# Altium schematic sheet PowerSupply.SchDoc
size A4
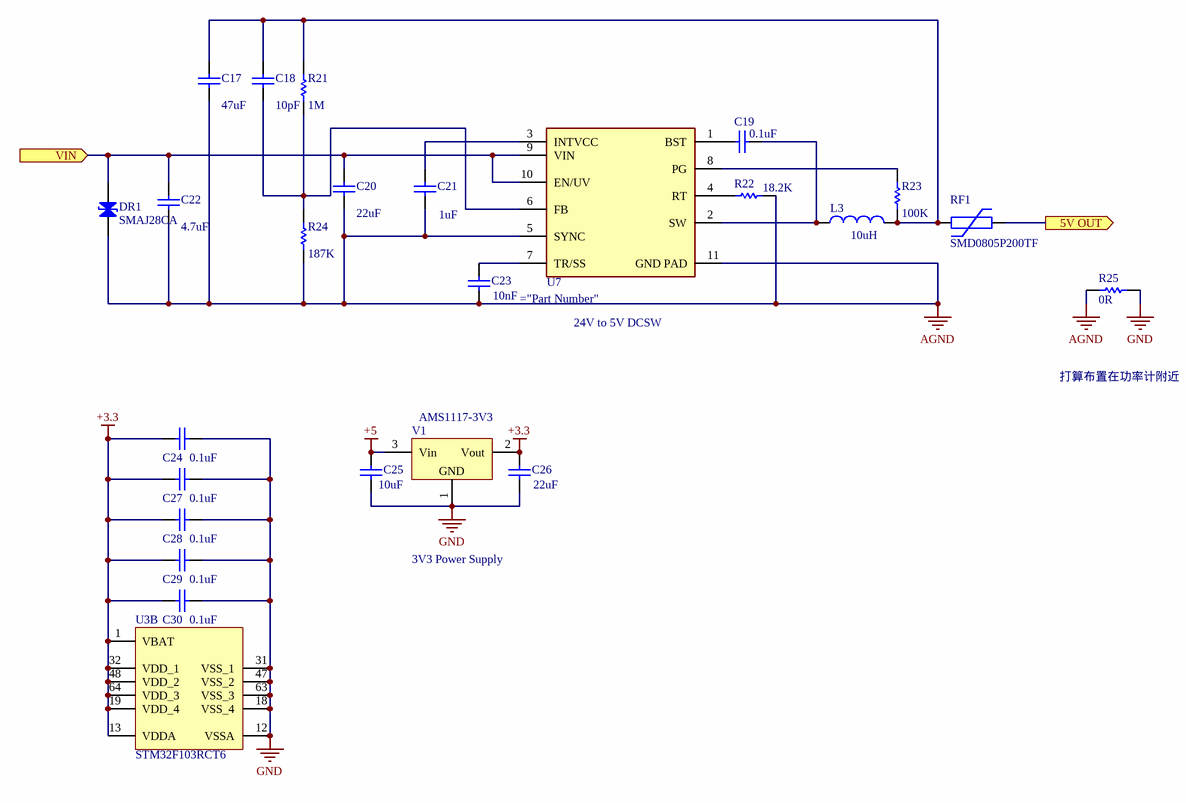
[diagram p0: PowerSupply.SchDoc]

## Parts
C17  value 47uF  [C1206]  (hidden comment: Cap)
C18  value 10pF  [C 0603_L]  (hidden comment: Cap)
C19  value 0.1uF  [C 0603_L]  (hidden comment: Cap)
C20  value 22uF  [C 1206_L]  (hidden comment: Cap)
C21  value 1uF  [C 0603_L]  (hidden comment: Cap)
C22  value 4.7uF  [C 1206_L]  (hidden comment: Cap)
C23  value 10nF  [C 0603_L]  (hidden comment: Cap)
C24  value 0.1uF  [0603C]  (hidden comment: Cap)
C25  value 10uF  [C 1206_L]  (hidden comment: Cap)
C26  value 22uF  [C 1206_L]  (hidden comment: Cap)
C27  value 0.1uF  [0603C]  (hidden comment: Cap)
C28  value 0.1uF  [0603C]  (hidden comment: Cap)
C29  value 0.1uF  [0603C]  (hidden comment: Cap)
C30  value 0.1uF  [0603C]  (hidden comment: Cap)
DR1  SMAJ28CA  [SMA]
L3  value 10uH  [XAL4040]  (hidden comment: Inductor)
R21  value 1M  [R 0603_L]  (hidden comment: Res1)
R22  value 18.2K  [R 0603_L]  (hidden comment: Res1)
R23  value 100K  [R 0603_L]  (hidden comment: Res1)
R24  value 187K  [R 0603_L]  (hidden comment: Res1)
R25  value 0R  [0805R]  (hidden comment: Res1)
RF1  SMD0805P200TF  [R 0805_L]
U3  STM32F103RCT6  [STM-LQFP64_N]  (part B of 2)
U7  LT8609EMSE#PBF  [LT8609EMS]  (value not drawn)
V1  AMS1117-3V3  [SOT223_N]

## Ports
5V OUT (out), VIN (in)

## Nets
+3.3: C24.1 C26.2 C27.1 C28.1 C29.1 C30.1 U3.1(VBAT) U3.13(VDDA) U3.19(VDD_4) U3.32(VDD_1) U3.48(VDD_2) U3.64(VDD_3) V1.2(Vout)
+5: C25.2 V1.3(Vin)
AGND: C17.1 C20.1 C21.1 C22.1 C23.1 DR1.2(K) R22.1 R24.2 R25.2 U7.5(SYNC) U7.11(GND_PAD)
GND: C24.2 C25.1 C26.1 C27.2 C28.2 C29.2 C30.2 R25.1 U3.12(VSSA) U3.18(VSS_4) U3.31(VSS_1) U3.47(VSS_2) U3.63(VSS_3) V1.1(GND)
5V OUT: RF1.2 ; port 5V OUT
VIN: C20.2 C22.2 DR1.1(A) U7.9(VIN) U7.10(EN/UV) ; port VIN
NetC17_2: C17.2 C18.2 L3.2 R21.1 R23.1 RF1.1
NetC18_1: C18.1 R21.2 R24.1 U7.6(FB)
NetC19_1: C19.1 L3.1 U7.2(SW)
NetC19_2: C19.2 U7.1(BST)
NetC21_2: C21.2 U7.3(INTVCC)
NetC23_2: C23.2 U7.7(TR/SS)
NetR22_2: R22.2 U7.4(RT)
NetR23_2: R23.2 U7.8(PG)

## Notes on the sheet
- 24V to 5V DCSW
- 打算布置在功率计附近
- 3V3 Power Supply

## Library data of the parts
C17 C25 C26 = Cap: X5R 25V; Published: 8-Jun-2000; LatestRevisionDate: 17-Jul-2002; LatestRevisionNote: Re-released for DXP Platform.; PackageReference: RAD-0.3; Publisher: Altium Limited; PackageDescription: Radial Cap, Thru-Hole; 2 Leads; 0.3 in Pin Spacing
C18 C23 = Cap: C0G 50V; Published: 8-Jun-2000; LatestRevisionDate: 17-Jul-2002; LatestRevisionNote: Re-released for DXP Platform.; PackageReference: RAD-0.3; Publisher: Altium Limited; PackageDescription: Radial Cap, Thru-Hole; 2 Leads; 0.3 in Pin Spacing
C19-C22 C24 C27-C30 = Cap: X5R 50V; Published: 8-Jun-2000; LatestRevisionDate: 17-Jul-2002; LatestRevisionNote: Re-released for DXP Platform.; PackageReference: RAD-0.3; Publisher: Altium Limited; PackageDescription: Radial Cap, Thru-Hole; 2 Leads; 0.3 in Pin Spacing
DR1 = DR: 瞬态电压抑制二极管; 版权归属: 源创客; BOM名称: 瞬态电压抑制二极管; 学习资源: www.ooocke.com
L3 = Inductor: XAL4040 10uH; Code_IEC: 1005; Published: 8-Jun-2000; LatestRevisionDate: 29-May-2009; LatestRevisionNote: IPC-7351 Footprint Added.; PackageReference: 0402-A; Publisher: Altium Limited; PackageDescription: Chip Inductor; Code_JEITA: 0402
R21-R25 = Res1: Resistor; Published: 8-Jun-2000; LatestRevisionDate: 17-Jul-2002; LatestRevisionNote: Re-released for DXP Platform.; PackageReference: AXIAL-0.3; Publisher: Altium Limited; PackageDescription: Axial Device, Thru-Hole; 2 Leads; 0.3 in Pin Spacing
RF1 = PPTC: PPTC自恢复保险丝; 版权归属: 源创客; BOM名称: PPTC自恢复保险丝; 学习资源: www.ooocke.com
U3 = STM32F103RCT6: ARM Cortex-M3 32-bit MCU, 256 KB Flash, 48 KB Internal RAM, 51 I/Os, 64-pin LQFP, -40 to 85 degC, Tray; A/D Converter: 3x12-bit (16 Channel); D/A Converter: 2x12-bit (2 Channel); FLASH Size (Prog) (kB): 256; I/Os (High Current): 51; Internal RAM Size (kB): 48; Operating Frequency(F) (Processor speed) (MHz): 72; Supply Voltage(Vcc) min (V): 2; DatasheetVersion: Rev. 8; PackageVersion: Rev. 4, 06/2013; PackageReference: LQFP64; PackageDescription: 64-Pin Low Profile Quad Flat Package, 10 x 10 mm Body, 0.5 mm Pitch; Supplier 1: Digi-Key; Supplier Part Number 1: 497-9033-ND; Supplier 2: Newark; Supplier Part Number 2: 01P4099; Supplier 3: Newark; Supplier Part Number 3: 57P1227; Supplier 4: Mouser; Supplier Part Number 4: 511-STM32F103RCT6; Core: ARM Cortex-M3; Packing: Tray; Mounting Technology: Surface Mount; PartNumber: STM32F103RCT6; ComponentLink1Description: Manufacturer URL; ComponentLink1URL: http://www.st.com/web/en/home.html; ComponentLink2Description: Datasheet; ComponentLink2URL: http://www.st.com/st-web-ui/static/active/en/resource/technical/document/datasheet/CD00191185.pdf; ComponentLink3Description: Package Specification; ComponentLink3URL: http://www.st.com/st-web-ui/static/active/en/resource/technical/document/datasheet/DM00037051.pdf
V1 = AMS1117: 三端稳压芯片; BOM名称: 稳压芯片; 版权归属: 源创客; 学习资源: www.ooocke.com